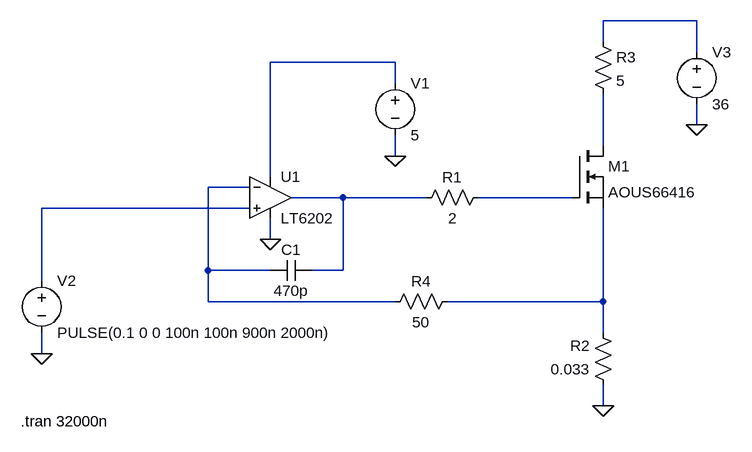
[diagram p0: schematic Constant Current Sink IR LED.asc]
Constant Current Sink IR LED.asc, the LTspice schematic file:
Version 4.1
SHEET 1 904 680
WIRE 848 -112 704 -112
WIRE 704 -80 704 -112
WIRE 848 -64 848 -112
WIRE 384 -48 192 -48
WIRE 384 -16 384 -48
WIRE 848 48 848 16
WIRE 704 80 704 0
WIRE 384 96 384 64
WIRE 192 128 192 -48
WIRE 160 144 96 144
WIRE 304 160 224 160
WIRE 432 160 304 160
WIRE 656 160 512 160
WIRE 160 176 -160 176
WIRE 192 224 192 192
WIRE 96 272 96 144
WIRE 192 272 96 272
WIRE 304 272 304 160
WIRE 304 272 256 272
WIRE -160 288 -160 176
WIRE 96 320 96 272
WIRE 384 320 96 320
WIRE 704 320 704 176
WIRE 704 320 464 320
WIRE 704 368 704 320
WIRE -160 400 -160 368
WIRE 704 480 704 448
FLAG 384 96 0
FLAG -160 400 0
FLAG 192 224 0
FLAG 704 480 0
FLAG 848 48 0
SYMBOL voltage 384 -32 R0
WINDOW 123 0 0 Left 0
WINDOW 39 0 0 Left 0
SYMATTR InstName V1
SYMATTR Value 5
SYMBOL voltage -160 272 R0
WINDOW 123 0 0 Left 0
WINDOW 39 0 0 Left 0
SYMATTR InstName V2
SYMATTR Value PULSE(0.1 0 0 100n 100n 900n 2000n)
SYMBOL res 528 144 R90
WINDOW 0 0 56 VBottom 2
WINDOW 3 32 56 VTop 2
SYMATTR InstName R1
SYMATTR Value 2
SYMBOL res 720 464 R180
WINDOW 0 36 76 Left 2
WINDOW 3 36 40 Left 2
SYMATTR InstName R2
SYMATTR Value 0.033
SYMBOL nmos 656 80 R0
SYMATTR InstName M1
SYMATTR Value AOUS66416
SYMBOL voltage 848 -80 R0
WINDOW 123 0 0 Left 0
WINDOW 39 0 0 Left 0
SYMATTR InstName V3
SYMATTR Value 36
SYMBOL res 688 -96 R0
SYMATTR InstName R3
SYMATTR Value 5
SYMBOL cap 256 256 R90
WINDOW 0 0 32 VBottom 2
WINDOW 3 32 32 VTop 2
SYMATTR InstName C1
SYMATTR Value 470p
SYMBOL res 480 304 R90
WINDOW 0 0 56 VBottom 2
WINDOW 3 32 56 VTop 2
SYMATTR InstName R4
SYMATTR Value 50
SYMBOL OpAmps\\LT6202 192 160 R0
SYMATTR InstName U1
TEXT -192 504 Left 2 !.tran 32000n

The netlist it stands for:
* Constant Current Sink IR LED.asc
V1 N002 0 5
V2 N007 0 PULSE(0.1 0 0 100n 100n 900n 2000n)
R1 N006 N005 2
R2 0 N008 0.033
M1 N003 N006 N008 N008 AOUS66416
V3 N001 0 36
R3 N001 N003 5
C1 N005 N004 470p
R4 N008 N004 50
* U1: LT6202 (symbol OpAmps\LT6202 not available, pins judged from their places): In+=N007 In-=N004 V+=N002 V-=0 OUT=N005
.model NMOS NMOS
.model PMOS PMOS
.lib standard.mos
.tran 32000n
.backanno
.end